# Altium schematic sheet MAIN.SchDoc: Smart Street Light System - Main Schematic Doc
size 431 x 279 mm; Author: Arvind Balaji Narayan, Gopik Anand; CompanyName: Cats_and_Dogs; Engineer: Arvind Balaji Narayan, Gopik Anand; Organization: University of Pennsylvania
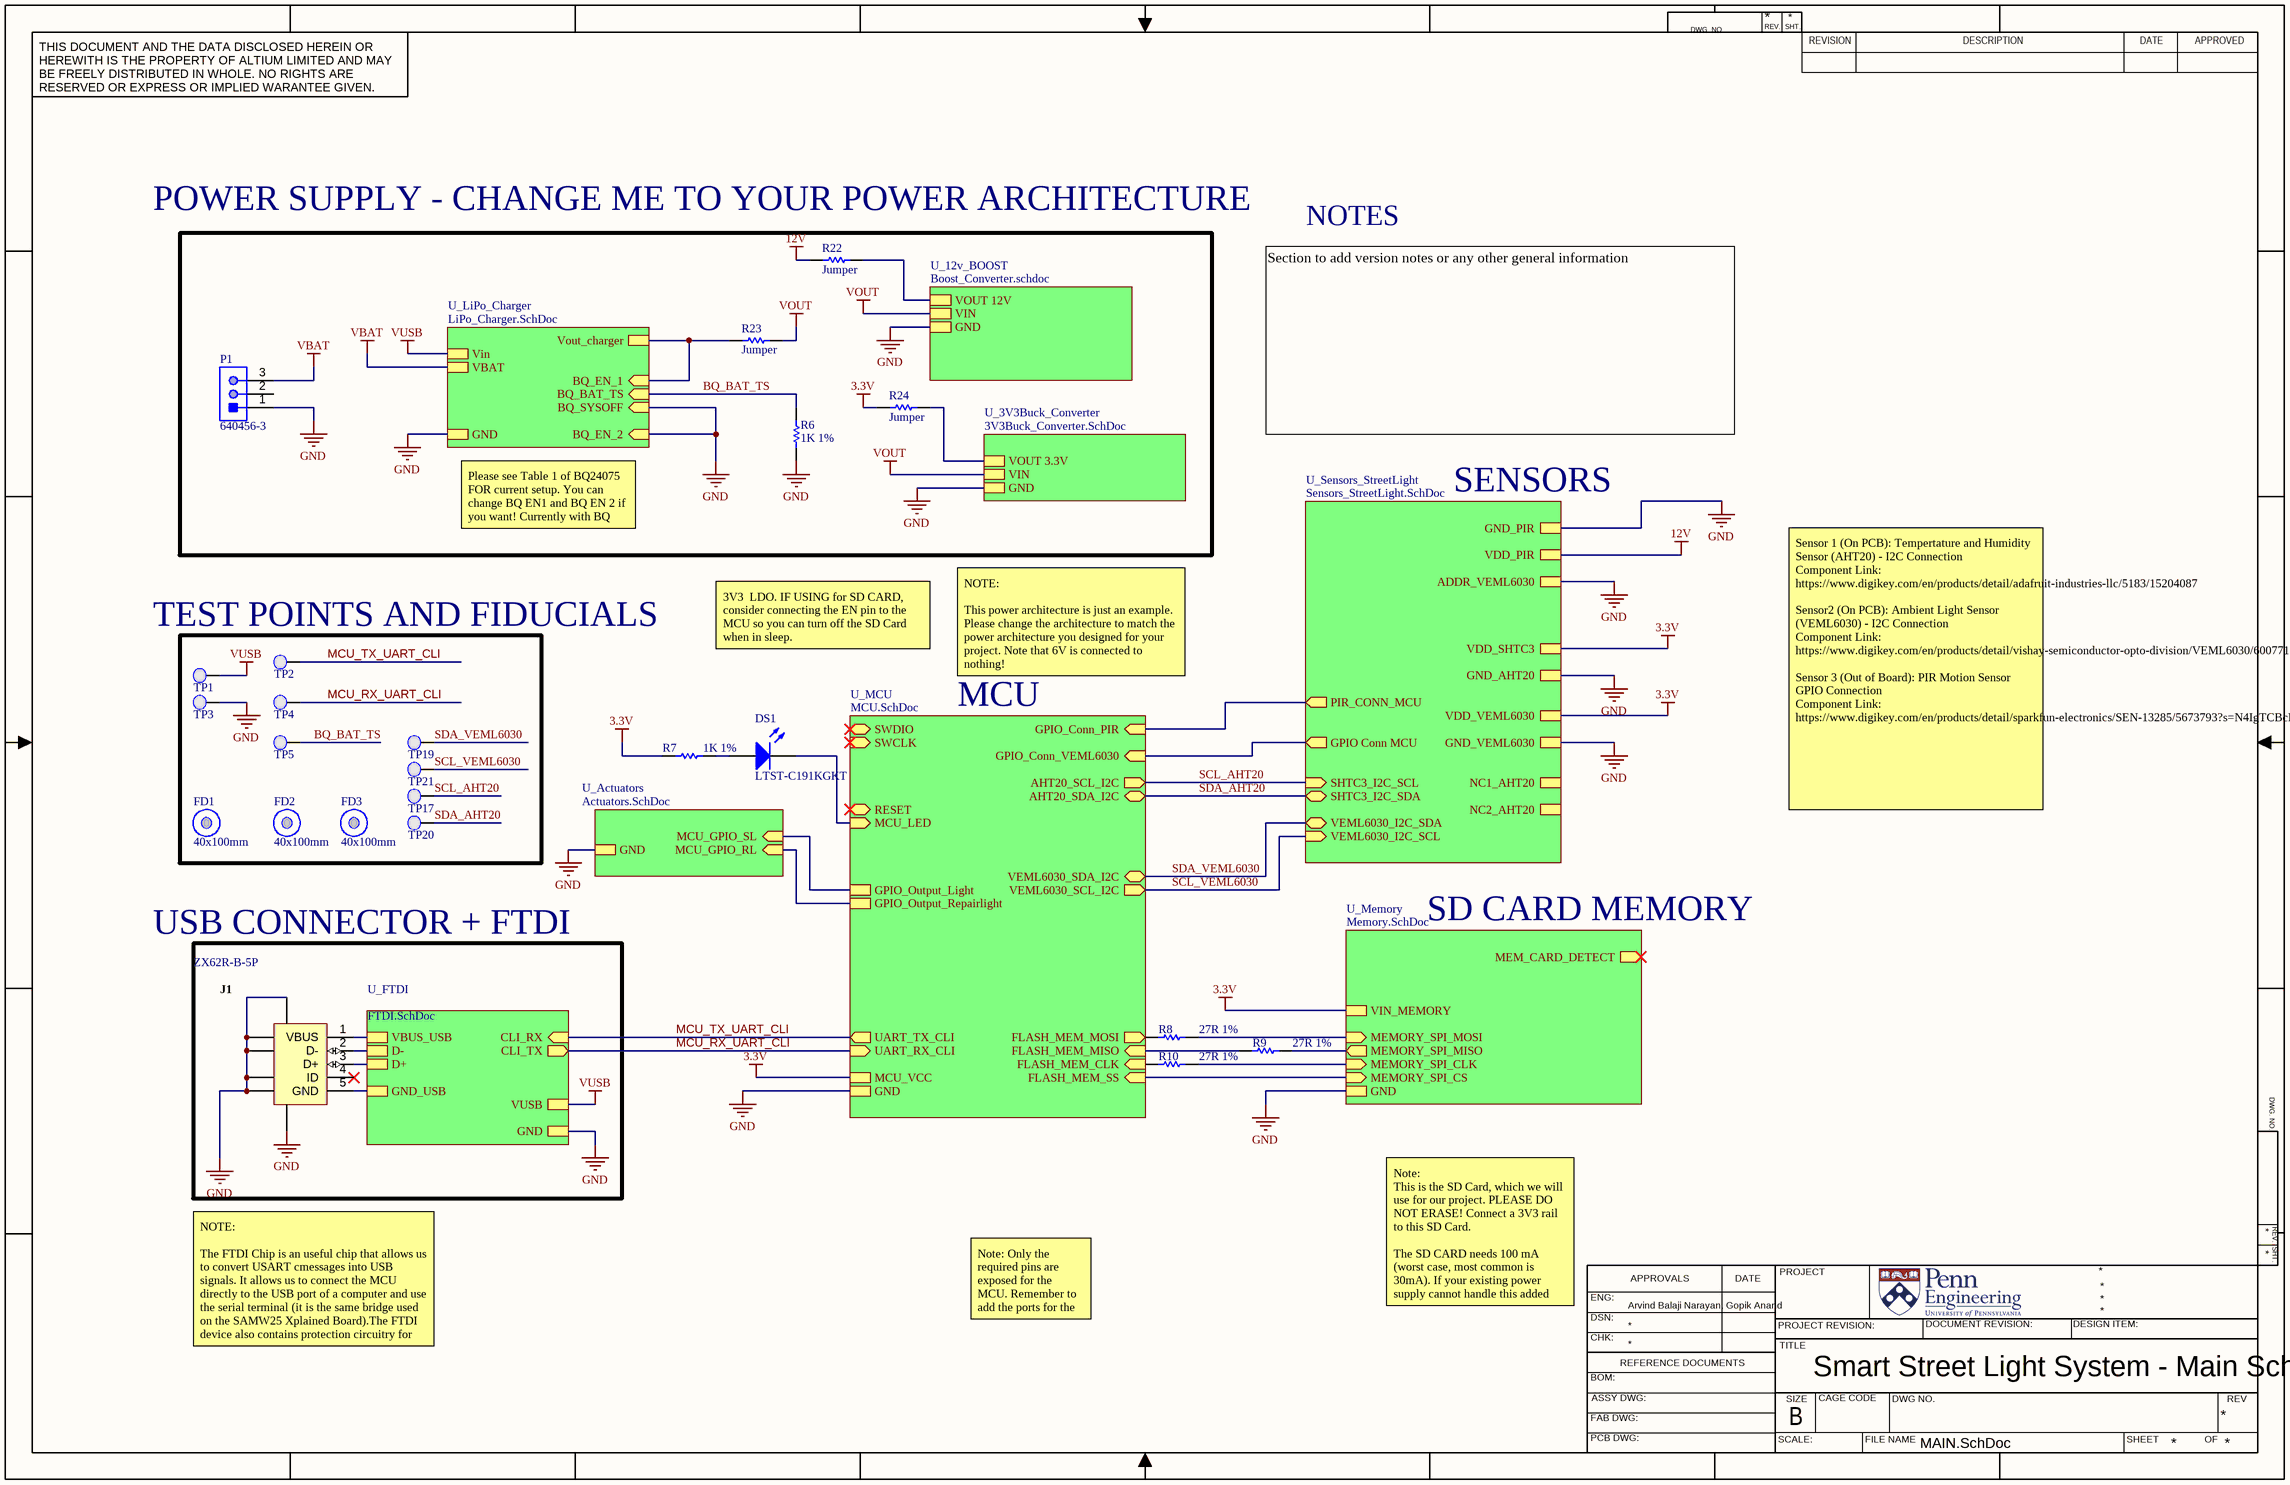
[diagram p0: MAIN.SchDoc]

## Parts
DS1  LTST-C191KGKT  [LITE-ON-LTST-C191KRKT-2_V]
FD1  40x100mm  [Fiducial_FT]  (no BOM)
FD2  40x100mm  [Fiducial_FT]  (no BOM)
FD3  40x100mm  [Fiducial_FT]  (no BOM)
J1  ZX62R-B-5P  [HIRO-ZX62R-B-5P_V]
P1  640456-3  [TECO-640456-3]
R6  1K 1%  [RESC0603(1608)_N]
R7  1K 1%  [RESC0603(1608)_N]
R8  27R 1%  [RESC0603(1608)_N]
R9  27R 1%  [RESC0603(1608)_N]
R10  27R 1%  [RESC0603(1608)_N]
R22  Jumper  [RESC0603(1608)_N]
R23  Jumper  [RESC0805(2012)_N]
R24  Jumper  [RESC0603(1608)_N]
TP1  0.1" Pad  [PCBComponent]  (value not drawn)  (no BOM)
TP2  0.1" Pad  [PCBComponent]  (value not drawn)  (no BOM)
TP3  0.1" Pad  [PCBComponent]  (value not drawn)  (no BOM)
TP4  0.1" Pad  [PCBComponent]  (value not drawn)  (no BOM)
TP5  0.1" Pad  [PCBComponent]  (value not drawn)  (no BOM)
TP17  0.1" Pad  [PCBComponent]  (value not drawn)  (no BOM)
TP19  0.1" Pad  [PCBComponent]  (value not drawn)  (no BOM)
TP20  0.1" Pad  [PCBComponent]  (value not drawn)  (no BOM)
TP21  0.1" Pad  [PCBComponent]  (value not drawn)  (no BOM)

## Sub-sheets
U_3V3Buck_Converter = 3V3Buck_Converter.SchDoc: VIN, GND, VOUT 3.3V
U_12v_BOOST = Boost_Converter.schdoc: VOUT 12V, VIN, GND
U_Actuators = Actuators.SchDoc: MCU_GPIO_SL (in), MCU_GPIO_RL (in), GND
U_FTDI = FTDI.SchDoc: CLI_RX (in), CLI_TX (out), VUSB, GND, VBUS_USB, D-, D+, GND_USB
U_LiPo_Charger = LiPo_Charger.SchDoc: BQ_EN_2 (in), BQ_SYSOFF (in), BQ_EN_1 (in), BQ_BAT_TS (in), Vin, GND, VBAT, Vout_charger
U_MCU = MCU.SchDoc: SWDIO (bidir), SWCLK (in), UART_TX_CLI (out), UART_RX_CLI (in), FLASH_MEM_SS (in), FLASH_MEM_CLK (in), FLASH_MEM_MISO (in), FLASH_MEM_MOSI (out), RESET (bidir), MCU_LED (in), MCU_VCC, GND, VEML6030_SDA_I2C (bidir), VEML6030_SCL_I2C (out), AHT20_SDA_I2C (bidir), AHT20_SCL_I2C (out), GPIO_Output_Light, GPIO_Output_Repairlight, GPIO_Conn_VEML6030 (in), GPIO_Conn_PIR (in)
U_Memory = Memory.SchDoc: MEMORY_SPI_MOSI (in), MEMORY_SPI_MISO (out), MEMORY_SPI_CLK (in), MEMORY_SPI_CS (in), MEM_CARD_DETECT (out), VIN_MEMORY, GND
U_Sensors_StreetLight = Sensors_StreetLight.SchDoc: ADDR_VEML6030, GPIO Conn MCU (out), GND_AHT20, VDD_SHTC3, VEML6030_I2C_SCL (in), VEML6030_I2C_SDA (bidir), VDD_VEML6030, GND_VEML6030, SHTC3_I2C_SCL (in), NC1_AHT20, SHTC3_I2C_SDA (bidir), NC2_AHT20, PIR_CONN_MCU (out), VDD_PIR, GND_PIR

## Nets
3.3V: R7.1 R24.2 ; sheet U_Memory/VIN_MEMORY, sheet U_MCU/MCU_VCC, sheet U_Sensors_StreetLight/VDD_SHTC3, sheet U_Sensors_StreetLight/VDD_VEML6030
12V: R22.2 ; sheet U_Sensors_StreetLight/VDD_PIR
GND: J1.6(SHLD) J1.7(SHLD) J1.8(SHLD) J1.9(SHLD) J1.10(SHLD) J1.11(SHLD) P1.1 R6.2 TP3.1(PAD) ; sheet U_FTDI/GND, sheet U_Memory/GND, sheet U_LiPo_Charger/BQ_EN_2, sheet U_LiPo_Charger/BQ_SYSOFF, sheet U_LiPo_Charger/GND, sheet U_12v_BOOST/GND, sheet U_MCU/GND, sheet U_Sensors_StreetLight/ADDR_VEML6030, sheet U_Sensors_StreetLight/GND_AHT20, sheet U_Sensors_StreetLight/GND_VEML6030, sheet U_Sensors_StreetLight/GND_PIR, sheet U_Actuators/GND, sheet U_3V3Buck_Converter/GND
VBAT: P1.3 ; sheet U_LiPo_Charger/VBAT
VOUT: R23.2 ; sheet U_12v_BOOST/VIN, sheet U_3V3Buck_Converter/VIN
VUSB: TP1.1(PAD) ; sheet U_FTDI/VUSB, sheet U_LiPo_Charger/Vin
BQ_BAT_TS: R6.1 TP5.1(PAD) ; sheet U_LiPo_Charger/BQ_BAT_TS
MCU_RX_UART_CLI: TP4.1(PAD) ; sheet U_FTDI/CLI_TX, sheet U_MCU/UART_RX_CLI
MCU_TX_UART_CLI: TP2.1(PAD) ; sheet U_FTDI/CLI_RX, sheet U_MCU/UART_TX_CLI
SCL_AHT20: TP17.1(PAD) ; sheet U_MCU/AHT20_SCL_I2C, sheet U_Sensors_StreetLight/SHTC3_I2C_SCL
SCL_VEML6030: TP21.1(PAD) ; sheet U_MCU/VEML6030_SCL_I2C, sheet U_Sensors_StreetLight/VEML6030_I2C_SCL
SDA_AHT20: TP20.1(PAD) ; sheet U_MCU/AHT20_SDA_I2C, sheet U_Sensors_StreetLight/SHTC3_I2C_SDA
SDA_VEML6030: TP19.1(PAD) ; sheet U_MCU/VEML6030_SDA_I2C, sheet U_Sensors_StreetLight/VEML6030_I2C_SDA
NetDS1_1: DS1.1(A) R7.2
NetDS1_2: DS1.2(K) ; sheet U_MCU/MCU_LED
NetJ1_1: J1.1(VBUS) ; sheet U_FTDI/VBUS_USB
NetJ1_2: J1.2(D-) ; sheet U_FTDI/D-
NetJ1_3: J1.3(D+) ; sheet U_FTDI/D+
NetJ1_5: J1.5(GND) ; sheet U_FTDI/GND_USB
NetR8_1: R8.1 ; sheet U_MCU/FLASH_MEM_MOSI
NetR8_2: R8.2 ; sheet U_Memory/MEMORY_SPI_MOSI
NetR9_1: R9.1 ; sheet U_MCU/FLASH_MEM_MISO
NetR9_2: R9.2 ; sheet U_Memory/MEMORY_SPI_MISO
NetR10_1: R10.1 ; sheet U_MCU/FLASH_MEM_CLK
NetR10_2: R10.2 ; sheet U_Memory/MEMORY_SPI_CLK
NetR22_1: R22.1 ; sheet U_12v_BOOST/VOUT 12V
NetR23_1: R23.1 ; sheet U_LiPo_Charger/BQ_EN_1, sheet U_LiPo_Charger/Vout_charger
NetR24_1: R24.1 ; sheet U_3V3Buck_Converter/VOUT 3.3V
(unnamed): sheet U_Memory/MEMORY_SPI_CS, sheet U_MCU/FLASH_MEM_SS
(unnamed): sheet U_MCU/GPIO_Output_Light, sheet U_Actuators/MCU_GPIO_SL
(unnamed): sheet U_MCU/GPIO_Output_Repairlight, sheet U_Actuators/MCU_GPIO_RL
(unnamed): sheet U_MCU/GPIO_Conn_VEML6030, sheet U_Sensors_StreetLight/GPIO Conn MCU
(unnamed): sheet U_MCU/GPIO_Conn_PIR, sheet U_Sensors_StreetLight/PIR_CONN_MCU

Not connected (* = marked no-connect by the designer): J1 4(ID)*; P1 2

## Notes on the sheet
- (near R22) POWER SUPPLY - CHANGE ME TO YOUR POWER ARCHITECTURE
- NOTES
- Section to add version notes or any other general information
- SENSORS
- Please see Table 1 of BQ24075 FOR current setup. You can change BQ EN1 and BQ EN 2 if you want! Currently with BQ EN 1 = 1 and BQ EN 2 = 2, the current from the USB is limited to 500 mA.
- TEST POINTS AND FIDUCIALS
- 3V3  LDO. IF USING for SD CARD, consider connecting the EN pin to the MCU so you can turn off the SD Card when in sleep.
- NOTE:
  This power architecture is just an example. Please change the architecture to match the power architecture you designed for your project. Note that 6V is connected to nothing!
- MCU
- Sensor 1 (On PCB): Tempertature and Humidity Sensor (AHT20) - I2C Connection
  Component Link: https://www.digikey.com/en/products/detail/adafruit-industries-llc/5183/15204087
  Sensor2 (On PCB): Ambient Light Sensor (VEML6030) - I2C Connection
  Component Link: https://www.digikey.com/en/products/detail/vishay-semiconductor-opto-division/VEML6030/6007711
  Sensor 3 (Out of Board): PIR Motion Sensor GPIO Connection
  Component Link: https://www.digikey.com/en/products/detail/sparkfun-electronics/SEN-13285/5673793?s=N4IgTCBcDaIM4FMB2BGAzGAHAVhAXQF8g(SEN13285)
- USB CONNECTOR + FTDI
- SD CARD MEMORY
- Note:
  This is the SD Card, which we will use for our project. PLEASE DO NOT ERASE! Connect a 3V3 rail to this SD Card.
  The SD CARD needs 100 mA (worst case, most common is 30mA). If your existing power supply cannot handle this added current, please use the 3V3 LDO found in this project to power your SD Card.
- NOTE:
  The FTDI Chip is an useful chip that allows us to convert USART cmessages into USB signals. It allows us to connect the MCU directly to the USB port of a computer and use the serial terminal (it is the same bridge used on the SAMW25 Xplained Board).The FTDI device also contains protection circuitry for the USB.
- Note: Only the required pins are exposed for the MCU. Remember to add the ports for the pins you need to be exposed!
- DWG. NO.
- REV.
- SHT.
- THIS DOCUMENT AND THE DATA DISCLOSED HEREIN OR HEREWITH IS THE PROPERTY OF ALTIUM LIMITED AND MAY BE FREELY DISTRIBUTED IN WHOLE. NO RIGHTS ARE RESERVED OR EXPRESS OR IMPLIED WARANTEE GIVEN.
- REVISION
- DESCRIPTION
- DATE
- APPROVED
- ENG:
- APPROVALS
- PROJECT
- DSN:
- CHK:
- REFERENCE DOCUMENTS
- PROJECT REVISION:
- TITLE
- DOCUMENT REVISION:
- DESIGN ITEM:
- BOM:
- FAB DWG:
- PCB DWG:
- ASSY DWG:
- SCALE:
- SIZE
- B
- CAGE CODE
- FILE NAME
- DWG NO.
- SHEET
- OF
- REV

## Library data of the parts
DS1 = CMP-2000-05198-1: Chip LED, Green, 574 nm, 40 pF, -55 to 85 degC, 2-Pin SMD, RoHS, Tape and Reel; Manufacturer: Lite-On; Rad Hardened: No; Emitting Color: YellowGreen; Product Height (mm): 0.55mm; Forward Voltage: 2.4V; Number of Elements: 1; Dominant Wave Length: 571nm; DELETED: Compliant; Viewing Angle: 130deg; High Brightness: Yes; Peak Wavelength: 574nm; Type: Uni-Color; Forward Current: 30mA; Product Length (mm): 1.6mm; Luminous Intensity: 35mcd; Test Current (It): 20mA; Chip Material: AlGaInP; Product Depth (mm): 0.8mm; Shape Type: Rectangular; Reverse Voltage: 5V; Power Dissipation: 75W; Pin Count: 2; Lens Dimensions: 1.1X0.8X0.37mm; Packaging: TapeandReel; Main Category: ChipLED; Operating Temperature Classification: Industrial; Package Type: ChipLed; Mounting: SurfaceMount; Lum Intensity: 35mcd; Operating Temp Range: -55Cto85C; Datasheet Version: Jan-07; Datasheet URL: http://download.siliconexpert.com/pdfs/2007/08/26/semi_b/manual/lot/ds/ltst-c191kgkt.pdf; Manufacturer URL: http://www.us.liteon.com/
FD1-FD3 = CMP-00174-A.4: Fiducial 40x100mm
J1 = CMP-0031-00001-1: Connector; USBMicro-B,Reverse type, SMT; 5 Position; Right Angle; DatasheetVersion: 08/2010; Operating Temperature: -30 to 85 degC; Mounting Technology: Surface Mount; PartNumber: ZX62R-B-5P; PackageReference: ZX62R-B-5P; ComponentLink2URL: http://www.hirose.co.jp/cataloge_hp/e24200011.pdf; ComponentLink1URL: http://www.hirose.com/â€Ž; ComponentLink2Description: Datasheet; PackageDescription: 5-Pin USB Micro-B R/A Connector; ComponentLink1Description: Manufacturer URL
P1 = CMP-2000-05418-1: Male Header, Pitch 2.54 mm, 1 x 3 Position, Height 10.03 mm, Tail Length 3.56 mm, -55 to 105 degC; Manufacturer: TE Connectivity; Agency Approvals: CSA,UL; Angle: Straight; Number of Positions: 3; Standards: RoHSCompliant,ELVCompliant,UL94V-0; Current, Rating: 5 / A; Connector Type: MTA-100; Mount Angle: Vertical; Material, Housing: Polyester; Temperature, Operating: -55to+105 / degC; Voltage, Rating: 250 / V; Color, Housing: White; Contact Centerline Spacing: 0.100 / in.; Special Features: Pinstrip; Material, Contact: CopperAlloy; Contact Termination Area Plating: Tin; Primary Type: InterconnectSystem; Pin Spacing: 0.1 / "; Brand/Series: MTA-100Series; Mounting Hole Size: 0.04 / "; Manufacturer URL: http://www.te.com/; Datasheet URL: https://datasheet.ciiva.com/16456/eng-ds-82056-mta-0608-16456886.pdf; Flammability Rating: UL94V-0; Mounting Type: PCMount; Contact Mating Area Plating: Tin; Datasheet Version: Jun-08; Number of Rows: 1; Termination: Solder; Type: PCBPlug; Length, Pin: 0.14 / "; Color: White; Contact Plating: Tin; Contact Shape: Square; Number of Contacts: 3; Size, Post: 0.025 / in.; Length, Terminal Post: 0.14 / in.; Length, Overall: 0.3 / "
R6 R7 = CMP-1012-00510-1: 1K 0.1W 1% 0603 (1608 Metric)  SMD; Case-Metric: 1608; Case-EIA: 0603; Value: 1000.00 Ohm; Technology: SMT; Tolerance: 1 %; Power: 0.1 W
R8-R10 = CMP-1012-00331-1: 27R 0.1W 1% 0603 (1608 Metric)  SMD; Case-EIA: 0603; Value: 27.00 Ohm; Case-Metric: 1608; Technology: SMT; Tolerance: 1 %; Power: 0.1 W
R22 R24 = CMP-1012-00001-1: Jumper 0603 (1608 Metric); Case-Metric: 1608; Value: 0.00 Ohm; Power: None; Case-EIA: 0603; Technology: SMT; Tolerance: None
R23 = CMP-1013-00001-1: Jumper 0805 (2012 Metric); Case-EIA: 0805; Value: 0.00 Ohm; Tolerance: None; Case-Metric: 2012; Technology: SMT; Power: None
TP1-TP5 TP17 TP19-TP21 = 0.1" Pad-A.4